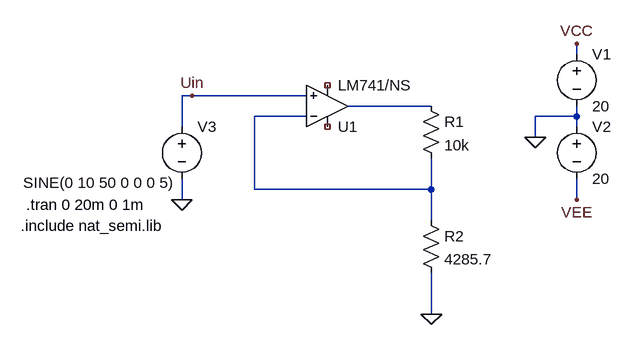
[diagram p0: schematic Inverterting2.asc]
Inverterting2.asc, the LTspice schematic file:
Version 4
SHEET 1 880 680
WIRE 512 64 512 48
WIRE -80 128 -96 128
WIRE 96 128 -80 128
WIRE 288 144 160 144
WIRE 96 160 16 160
WIRE 512 160 512 144
WIRE 512 160 448 160
WIRE -96 176 -96 128
WIRE 512 176 512 160
WIRE 448 192 448 160
WIRE 16 272 16 160
WIRE 288 272 288 224
WIRE 288 272 16 272
WIRE -96 288 -96 256
WIRE 512 288 512 256
WIRE 288 320 288 272
WIRE 288 464 288 400
FLAG 512 48 VCC
FLAG 512 288 VEE
FLAG 448 192 0
FLAG -96 288 0
FLAG 288 464 0
FLAG -80 128 Uin
SYMBOL Opamps\\opamp2 128 208 M180
SYMATTR InstName U1
SYMATTR Value LM741/NS
SYMBOL voltage 512 48 R0
SYMATTR InstName V1
SYMATTR Value 20
SYMBOL voltage 512 160 R0
SYMATTR InstName V2
SYMATTR Value 20
SYMBOL voltage -96 160 R0
WINDOW 3 -244 102 Left 2
WINDOW 123 0 0 Left 2
WINDOW 39 0 0 Left 2
SYMATTR Value SINE(0 10 50 0 0 0 5)
SYMATTR InstName V3
SYMBOL res 272 128 R0
SYMATTR InstName R1
SYMATTR Value 10k
SYMBOL res 272 304 R0
SYMATTR InstName R2
SYMATTR Value 4285.7
TEXT -344 328 Left 2 !.include nat_semi.lib
TEXT -336 296 Left 2 !.tran 0 20m 0 1m

The netlist it stands for:
* Inverterting2.asc
XU1 Uin N002 NC_01 NC_02 N001 LM741/NS  ; pins In+ In- V+ V- OUT
V1 VCC 0 20
V2 0 VEE 20
V3 Uin 0 SINE(0 10 50 0 0 0 5)
R1 N001 N002 10k
R2 N002 0 4285.7
.include nat_semi.lib
.tran 0 20m 0 1m
.backanno
.end